# Altium project Fujin_V1.PrjPcb
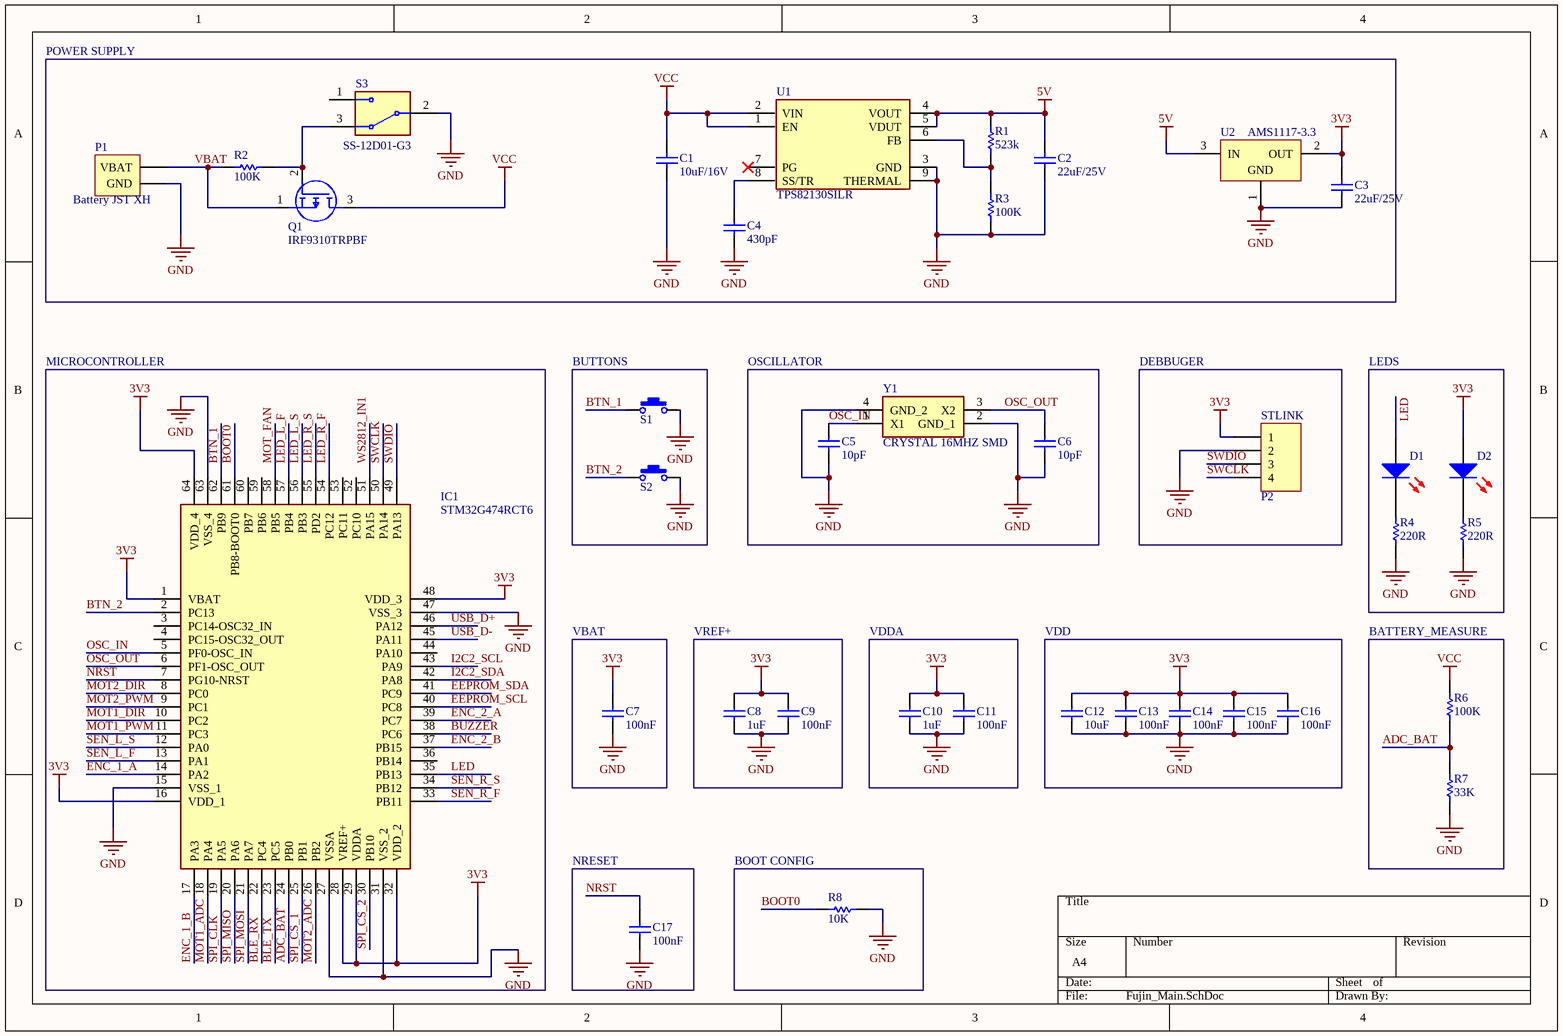
[diagram p0: Fujin_Main.SchDoc]
4 sheets, 108 parts. Net scope: global (net labels, ports and power ports of the same name join across sheets).
Board file: Fujin_Body.PcbDoc
Sheets:
  Fujin_Main.SchDoc
  Fujin_Peripherals.SchDoc
  Fujin_Motors.SchDoc
  Fujin_Connectors.SchDoc

## Sheet Fujin_Main.SchDoc
size A4; SheetNumber: 1; SheetTotal: 4

### Parts
C1  10uF/16V  [CAPACITOR-0805]
C2  22uF/25V  [CAPACITOR-0805]
C3  22uF/25V  [CAPACITOR-0805]
C4  430pF  [Capacitor-0603]
C5  10pF  [CAP 0402]
C6  10pF  [CAP 0402]
C7  100nF  [CAP 0402]
C8  1uF  [Capacitor-0603]
C9  100nF  [CAP 0402]
C10  1uF  [Capacitor-0603]
C11  100nF  [CAP 0402]
C12  10uF  [CAPACITOR-0805]
C13  100nF  [CAP 0402]
C14  100nF  [CAP 0402]
C15  100nF  [CAP 0402]
C16  100nF  [CAP 0402]
C17  100nF  [CAP 0402]
D1  LED RED 0603  [LED 0603]  (value not drawn)
D2  LED RED 0603  [LED 0603]  (value not drawn)
IC1  STM32G474RCT6  [QFP50P1200X1200X160-64N]
P1  Battery JST XH  [JST XH 1x2 Straight]
P2  Header 1x4  [HDR MALE 1x4]  (value not drawn)
Q1  IRF9310TRPBF  [IRF9310TRPBF]
R1  523k  [RESISTOR 0603]
R2  100K  [RESISTOR 0603]
R3  100K  [RESISTOR 0603]
R4  220R  [RESISTOR 0603]
R5  220R  [RESISTOR 0603]
R6  100K  [RESISTOR 0603]
R7  33K  [RESISTOR 0603]
R8  10K  [RESISTOR 0402]
S1  SPST-NO  [B3U-1000P]  (value not drawn)
S2  SPST-NO  [B3U-1000P]  (value not drawn)
S3  SS-12D01-G3  [DEALON SS-12D01-G3]
U1  TPS82130SILR  [SIL0008D]
U2  AMS1117-3.3  [SOT223 - AMS1117]
Y1  CRYSTAL 16MHZ SMD  [ABM10W240000MHZ8K1ZT3]

### Blocks framed on the sheet
POWER SUPPLY: C1-C4 P1 Q1 R1-R3 S3 U1 U2
MICROCONTROLLER: IC1
BUTTONS: S1 S2
OSCILLATOR: C5 C6 Y1
LEDS: D1 D2 R4 R5
VBAT: C7
VREF+: C8 C9
VDDA: C10 C11
VDD: C12-C16
BATTERY_MEASURE: R6 R7
NRESET: C17
BOOT CONFIG: R8

### Nets
3V3: C3.2 C7.2 C8.2 C9.2 C10.2 C11.2 C12.2 C13.2 C14.2 C15.2 C16.2 D2.1(A) IC1.1(VBAT) IC1.16(VDD_1) IC1.28(VREF+) IC1.29(VDDA) IC1.32(VDD_2) IC1.48(VDD_3) IC1.64(VDD_4) P2.1 U2.2(OUT)
5V: C2.2 R1.2 U1.4(VOUT) U1.5(VDUT) U2.3(IN)
GND: C1.1 C2.1 C3.1 C4.1 C5.1 C6.1 C7.1 C8.1 C9.1 C10.1 C11.1 C12.1 C13.1 C14.1 C15.1 C16.1 C17.1 IC1.15(VSS_1) IC1.27(VSSA) IC1.31(VSS_2) IC1.47(VSS_3) IC1.63(VSS_4) P1.2(GND) P2.2 R3.1 R4.1 R5.1 R7.1 R8.2 S1.2 S2.2 S3.2(COM) U1.3(GND) U1.9(THERMAL) U2.1(GND) Y1.2(GND_1) Y1.4(GND_2)
VCC: C1.2 Q1.3(D) R6.2 U1.1(EN) U1.2(VIN)
ADC_BAT: IC1.24(PB0) R6.1 R7.2
BLE_RX: IC1.22(PC4)
BLE_TX: IC1.23(PC5)
BOOT0: IC1.61(PB8-BOOT0) R8.1
BTN_1: IC1.62(PB9) S1.1
BTN_2: IC1.2(PC13) S2.1
BUZZER: IC1.38(PC6)
EEPROM_SCL: IC1.40(PC8)
EEPROM_SDA: IC1.41(PC9)
ENC_1_A: IC1.14(PA2)
ENC_1_B: IC1.17(PA3)
ENC_2_A: IC1.39(PC7)
ENC_2_B: IC1.37(PB15)
I2C2_SCL: IC1.43(PA9)
I2C2_SDA: IC1.42(PA8)
LED: D1.1(A) IC1.35(PB13)
LED_L_F: IC1.57(PB4)
LED_L_S: IC1.56(PB3)
LED_R_F: IC1.54(PC12)
LED_R_S: IC1.55(PD2)
MOT1_ADC: IC1.18(PA4)
MOT1_DIR: IC1.10(PC2)
MOT1_PWM: IC1.11(PC3)
MOT2_ADC: IC1.26(PB2)
MOT2_DIR: IC1.8(PC0)
MOT2_PWM: IC1.9(PC1)
MOT_FAN: IC1.58(PB5)
NRST: C17.2 IC1.7(PG10-NRST)
OSC_IN: C5.2 IC1.5(PF0-OSC_IN) Y1.1(X1)
OSC_OUT: C6.2 IC1.6(PF1-OSC_OUT) Y1.3(X2)
SEN_L_F: IC1.13(PA1)
SEN_L_S: IC1.12(PA0)
SEN_R_F: IC1.33(PB11)
SEN_R_S: IC1.34(PB12)
SPI_CLK: IC1.19(PA5)
SPI_CS_1: IC1.25(PB1)
SPI_CS_2: IC1.30(PB10)
SPI_MISO: IC1.20(PA6)
SPI_MOSI: IC1.21(PA7)
SWCLK: IC1.50(PA14) P2.4
SWDIO: IC1.49(PA13) P2.3
USB_D+: IC1.46(PA12)
USB_D-: IC1.45(PA11)
VBAT: P1.1(VBAT) Q1.1(S) R2.1
WS2812_IN1: IC1.51(PA15)
NetC4_2: C4.2 U1.8(SS/TR)
NetD1_2: D1.2(K) R4.2
NetD2_2: D2.2(K) R5.2
NetQ1_2: Q1.2(G) R2.2 S3.3(NO)
NetR1_1: R1.1 R3.2 U1.6(FB)

Not connected (* = marked no-connect by the designer): IC1 3(PC14-OSC32_IN) 4(PC15-OSC32_OUT) 36(PB14) 44(PA10) 52(PC10) 53(PC11) 59(PB6) 60(PB7); S3 1(NC); U1 7(PG)*

### Notes on the sheet
- DEBBUGER
- (near P2) STLINK

### Library data of the parts
C1 C12 = CAP CER 10UF 16V X5R 0805: Manufacturer: AVX Corporation; Manufacturer Part Number: 0805YD106KAT2A; Capacitance: 10µF; Tolerance: ±10%; Supplier 1: Digi-Key; RoHS: RoHS Compliant; Category: Capacitors; Stock 1: 198871; Pricing 1: 1=0.18, 10=0.124, 25=0.0908, 50=0.0742, 100=0.0627, 250=0.05116, 500=0.0429, 1000=0.03795 (USD); Packaging: Cut Tape (CT); Part Status: Active; Voltage - Rated: 16V; Temperature Coefficient: X5R; Mounting Type: Surface Mount, MLCC; Operating Temperature: -55°C ~ 85°C; Applications: General Purpose; Ratings: -; Package / Case: 0805 (2012 Metric); Size / Dimension: 0.079" L x 0.049" W (2.01mm x 1.25mm); Height - Seated (Max): -; Thickness (Max): 0.055" (1.40mm); Lead Spacing: -; Features: -; Lead Style: -; ComponentLink1URL: http://datasheets.avx.com/cx5r.pdf; ComponentLink1Description: http://datasheets.avx.com/cx5r.pdf; Supplier Part Number 1: 478-5165-1-ND
C2 C3 = CAP CER 22UF 25V X5R 0805: Manufacturer: AVX Corporation; Manufacturer Part Number: 0805YD106KAT2A; Capacitance: 10µF; Tolerance: ±10%; Voltage - Rated: 16V; Supplier 1: Digi-Key; RoHS: RoHS Compliant; Category: Capacitors; Stock 1: 198871; Pricing 1: 1=0.18, 10=0.124, 25=0.0908, 50=0.0742, 100=0.0627, 250=0.05116, 500=0.0429, 1000=0.03795 (USD); Packaging: Cut Tape (CT); Part Status: Active; Temperature Coefficient: X5R; Mounting Type: Surface Mount, MLCC; Operating Temperature: -55°C ~ 85°C; Applications: General Purpose; Ratings: -; Package / Case: 0805 (2012 Metric); Size / Dimension: 0.079" L x 0.049" W (2.01mm x 1.25mm); Height - Seated (Max): -; Thickness (Max): 0.055" (1.40mm); Lead Spacing: -; Features: -; Lead Style: -; ComponentLink1URL: https://www.lcsc.com/product-detail/Multilayer-Ceramic-Capacitors-MLCC-SMD-SMT_Murata-Electronics-GRM21BR61E226ME44L_C86816.html; ComponentLink1Description: http://datasheets.avx.com/cx5r.pdf; Supplier Part Number 1: 478-5165-1-ND
C4 = CAP 430pF: Capacitor Cer 430pF; Manufacturer Part Number: IMP14925; Product Range: MCFY Series; Capacitance Tolerance: +80%, -20%; Dielectric Characteristic: Y5; Voltage Rating: 50; Capacitor Terminals: Radial Leaded; SVHC: No SVHC (15-Jun-2015); Supplier 1: Mult Comercial; Manufacturer: -; RoHS: YES; Stock 1: 115809; Pricing 1: 1=0.10 (BRL); Packaging: Each; Lead Spacing: 5; Operating Temperature Min: -25; Operating Temperature Max: 85; Capacitance Tolerance ±: +80%, -20%; Operating Temperature Range: -25°C to +85°C<!--FANDB--><div class="features-and-benefits-container"><div class="features-and-benefits-description"><span class="features-benefits-value">The MCFY series from Multicomp are radial leaded ceramic disc capacitors. The capacitance values ranges from 6800pF to 0.22?F.</span></div><div class="features-and-benefits-list"><ul class="features-and-benefits-list-list"><li class="features-and-benefits-list-item">Large capacitance in small size</li><li class="features-and-benefits-list-item">Rated voltage of 50V</li><li class="features-and-benefits-list-item">80%/-20% tolerance</li><li class="features-and-benefits-list-item">Operating temperature range -25°C to +85; ComponentLink1URL: http://loja.multcomercial.com.br/capacitor-ceramico-disco-100kpf-50v-104-100k-100nf-0-1uf-cod-1351.html; ComponentLink1Description: http://loja.multcomercial.com.br/capacitor-ceramico-disco-100kpf-50v-104-100k-100nf-0-1uf-cod-1351.html; Supplier Part Number 1: Capacitor Cerâmico Disco 100Kpf/50V (104/100K/100nF/0.1uF) cód. 1351
C5 C6 = CAP 10pF: Capacitor Cer 10pF; Manufacturer Part Number: IMP14925; Product Range: MCFY Series; Capacitance Tolerance: +80%, -20%; Dielectric Characteristic: Y5; Voltage Rating: 50; Capacitor Terminals: Radial Leaded; SVHC: No SVHC (15-Jun-2015); Supplier 1: Mult Comercial; Manufacturer: -; RoHS: YES; Stock 1: 115809; Pricing 1: 1=0.10 (BRL); Packaging: Each; Lead Spacing: 5; Operating Temperature Min: -25; Operating Temperature Max: 85; Capacitance Tolerance ±: +80%, -20%; Operating Temperature Range: -25°C to +85°C<!--FANDB--><div class="features-and-benefits-container"><div class="features-and-benefits-description"><span class="features-benefits-value">The MCFY series from Multicomp are radial leaded ceramic disc capacitors. The capacitance values ranges from 6800pF to 0.22?F.</span></div><div class="features-and-benefits-list"><ul class="features-and-benefits-list-list"><li class="features-and-benefits-list-item">Large capacitance in small size</li><li class="features-and-benefits-list-item">Rated voltage of 50V</li><li class="features-and-benefits-list-item">80%/-20% tolerance</li><li class="features-and-benefits-list-item">Operating temperature range -25°C to +85; ComponentLink1URL: http://loja.multcomercial.com.br/capacitor-ceramico-disco-100kpf-50v-104-100k-100nf-0-1uf-cod-1351.html; ComponentLink1Description: http://loja.multcomercial.com.br/capacitor-ceramico-disco-100kpf-50v-104-100k-100nf-0-1uf-cod-1351.html; Supplier Part Number 1: Capacitor Cerâmico Disco 100Kpf/50V (104/100K/100nF/0.1uF) cód. 1351
C7 C9 C11 C13-C17 = CAP 100NF 50V 0402: Capacitor Cer 100nF 50V 0402; Manufacturer Part Number: IMP14925; Product Range: MCFY Series; Capacitance: 0.1uF; Capacitance Tolerance: +80%, -20%; Dielectric Characteristic: Y5; Voltage Rating: 50; Capacitor Terminals: Radial Leaded; SVHC: No SVHC (15-Jun-2015); Supplier 1: Mult Comercial; Manufacturer: -; RoHS: YES; Stock 1: 115809; Pricing 1: 1=0.10 (BRL); Packaging: Each; Lead Spacing: 5; Operating Temperature Min: -25; Operating Temperature Max: 85; Capacitance Tolerance ±: +80%, -20%; Operating Temperature Range: -25°C to +85°C<!--FANDB--><div class="features-and-benefits-container"><div class="features-and-benefits-description"><span class="features-benefits-value">The MCFY series from Multicomp are radial leaded ceramic disc capacitors. The capacitance values ranges from 6800pF to 0.22?F.</span></div><div class="features-and-benefits-list"><ul class="features-and-benefits-list-list"><li class="features-and-benefits-list-item">Large capacitance in small size</li><li class="features-and-benefits-list-item">Rated voltage of 50V</li><li class="features-and-benefits-list-item">80%/-20% tolerance</li><li class="features-and-benefits-list-item">Operating temperature range -25°C to +85; ComponentLink1URL: http://loja.multcomercial.com.br/capacitor-ceramico-disco-100kpf-50v-104-100k-100nf-0-1uf-cod-1351.html; ComponentLink1Description: http://loja.multcomercial.com.br/capacitor-ceramico-disco-100kpf-50v-104-100k-100nf-0-1uf-cod-1351.html; Supplier Part Number 1: Capacitor Cerâmico Disco 100Kpf/50V (104/100K/100nF/0.1uF) cód. 1351
C8 C10 = CAP CER 1UF 50V 0603: Multilayer Ceramic Capacitors MLCC - SMD/SMT 1uF 50Volts X5R +/-10% 0603 STD; Manufacturer: Taiyo Yuden; Manufacturer Part Number: UMK107BJ105KA-T; Tolerance: 10 %; Type: Industrial/Automotive and Safety; Voltage Rating DC: 50 VDC; Class: Class 2; Qualification: AEC-Q200; Supplier 1: Mouser; RoHS: RoHS Compliant; Category: Multilayer Ceramic Capacitors MLCC - SMD/SMT; Stock 1: 123303; Pricing 1: 1=0.512, 10=0.187, 100=0.101, 500=0.072, 1000=0.053, 4000=0.053, 8000=0.038, 12000=0.034, 24000=0.032 (AUD); Capacitance: 1 uF; Height: 0.8 mm; Length: 1.6 mm; Package / Case: 0603 (1608 metric); Packaging: Reel; Product: General Type MLCCs; Series: M; Termination Style: SMD/SMT; Width: 0.8 mm; Brand: Taiyo Yuden; Case Code - in: 0603; Case Code - mm: 1608; Dielectric: X5R; Maximum Operating Temperature: + 85 C; Minimum Operating Temperature: - 55 C; Termination: -; RoHS - Mouser: Y; Minimum Order Quantity: 1; Reeling: True; ComponentLink1URL: http://www.mouser.com/ds/2/396/mlcc_all_e-541559.pdf; ComponentLink1Description: http://www.mouser.com/ds/2/396/mlcc_all_e-541559.pdf; Supplier Part Number 1: 1uF
D1 D2 = LED RED 0603: LED; Manufacturer_Name: ROHM Semiconductor; Manufacturer_Part_Number: SML-D12U1WT86; Datasheet Link: https://componentsearchengine.com/Datasheets/1/SML-D12U1WT86.pdf; Height: 0.65mm; Mouser Part Number: 755-SML-D12U1WT86; Mouser Price/Stock: https://www.mouser.co.uk/ProductDetail/ROHM-Semiconductor/SML-D12U1WT86?qs=M3jcYzEJUdEySuGkbjHEtQ%3D%3D
IC1 = STM32G474RCT6: Integrated Circuit; Manufacturer_Name: STMicroelectronics; Datasheet Link: https://www.mouser.it/datasheet/2/389/dm00431551-1799305.pdf; Height: 1.6mm; Manufacturer_Part_Number: STM32G474RCT6; Mouser Part Number: 511-STM32G474RCT6; Mouser Price/Stock: https://www.mouser.co.uk/ProductDetail/STMicroelectronics/STM32G474RCT6?qs=uwxL4vQweFOU%2FtVbMPY7ow%3D%3D
P1 = Battery Connector
P2 = Header 1x4: Headers & Wire Housings 40Pin 2mm Spacing Single Row Hdrs, 5pc; Manufacturer: Cromax; Manufacturer Part Number: IMP10327; Mounting Angle: Vertical; Number of Positions: 40 Position; Supplier 1: Mult Comercial; RoHS: RoHS Compliant; Category: Headers & Wire Housings; Stock 1: 14; Pricing 1: 1=1.00, 5=0.20 (BRL); Accessory Type: -; Contact Plating: Gold; Contact Type: -; Number of Rows: 1 Row; Product: Headers; Termination Style: Through Hole; Type: Breakaway; Brand: Cromax; Mounting Style: Straight Pin; Pitch: 2 mm; Row Spacing: -; Contact Gender: Pin (Male); Product Category: Accessories; RoHS - Mouser: Y; Minimum Order Quantity: 1; Reeling: False; ComponentLink1URL: http://loja.multcomercial.com.br/barra-de-pinos-simples-1x40-macho-bmo40-1e.html; ComponentLink1Description: http://loja.multcomercial.com.br/barra-de-pinos-simples-1x40-macho-bmo40-1e.html; Supplier Part Number 1: Barra de Pinos Simples 1x40 Macho BMO40-1E
Q1 = IRF9310TRPBF: MOSFET (P-Channel); Manufacturer_Name: Infineon; Datasheet Link: http://uk.rs-online.com/web/p/products/8273912; Height: 1.75mm; Manufacturer_Part_Number: IRF9310TRPBF; Mouser Part Number: 942-IRF9310TRPBF; Mouser Price/Stock: https://www.mouser.co.uk/ProductDetail/Infineon-Technologies/IRF9310TRPBF?qs=9%252BKlkBgLFf0NoechZyOTDg%3D%3D; Arrow Part Number: IRF9310TRPBF; Arrow Price/Stock: https://www.arrow.com/en/products/irf9310trpbf/infineon-technologies-ag
R1 = RES 523K 1%: ComponentLink1URL: http://www.farnell.com/datasheets/1678796.pdf; ComponentLink1Description: http://www.farnell.com/datasheets/1678796.pdf; Category: Resistors; Resistance (Ohms): 523k; ComponentLink2URL: http://industrial.panasonic.com/www-cgi/jvcr13pz.cgi?E+PZ+3+AOA0001+ERJ3GEYJ103V+7+WW; ComponentLink2Description: http://industrial.panasonic.com/www-cgi/jvcr13pz.cgi?E+PZ+3+AOA0001+ERJ3GEYJ103V+7+WW
R2 = RES 100K 5%: ComponentLink1URL: http://www.farnell.com/datasheets/1678796.pdf; ComponentLink1Description: http://www.farnell.com/datasheets/1678796.pdf; Category: Resistors; Resistance (Ohms): 100k; ComponentLink2URL: http://industrial.panasonic.com/www-cgi/jvcr13pz.cgi?E+PZ+3+AOA0001+ERJ3GEYJ103V+7+WW; ComponentLink2Description: http://industrial.panasonic.com/www-cgi/jvcr13pz.cgi?E+PZ+3+AOA0001+ERJ3GEYJ103V+7+WW
R3 R6 = RES 100K 1%: ComponentLink1URL: http://www.farnell.com/datasheets/1678796.pdf; ComponentLink1Description: http://www.farnell.com/datasheets/1678796.pdf; Category: Resistors; Resistance (Ohms): 100k; ComponentLink2URL: http://industrial.panasonic.com/www-cgi/jvcr13pz.cgi?E+PZ+3+AOA0001+ERJ3GEYJ103V+7+WW; ComponentLink2Description: http://industrial.panasonic.com/www-cgi/jvcr13pz.cgi?E+PZ+3+AOA0001+ERJ3GEYJ103V+7+WW
R4 R5 = RES 220R 5%_1: Manufacturer: Ty-Ohm; Manufacturer Part Number: CR25; Tolerance: ±5%; Power (Watts): 0.25W, 1/4W; Temperature Coefficient: 0/ -500ppm/°C; Resistance (Ohms): 470R; Supplier 1: Mult Comercial; RoHS: RoHS Compliant; Category: Resistors; Stock 1: 617543; Pricing 1: 1=0.20 (BRL); Packaging: Cut Tape (CT); Composition: Carbon Film; Features: Flame Retardant Coating, Safety; Operating Temperature: -55°C ~ 155°C; Package / Case: Axial; Supplier Device Package: Axial; Size / Dimension: 0.091" Dia x 0.256" L (2.30mm x 6.50mm); Height: -; Number of Terminations: 2; ComponentLink1URL: http://loja.multcomercial.com.br/resistor-de-1-4-de-watt-cr25-5-de-tolerancia.html; ComponentLink1Description: http://loja.multcomercial.com.br/resistor-de-1-4-de-watt-cr25-5-de-tolerancia.html; Supplier Part Number 1: Resistor de Filme de Carbono 1/4 de Watt CR25 5% de tolerância - 0.22R Ω à 10M Ω
R7 = RES 33K 1%: ComponentLink1URL: http://www.farnell.com/datasheets/1678796.pdf; ComponentLink1Description: http://www.farnell.com/datasheets/1678796.pdf; ComponentLink2URL: http://industrial.panasonic.com/www-cgi/jvcr13pz.cgi?E+PZ+3+AOA0001+ERJ3GEYJ103V+7+WW; ComponentLink2Description: http://industrial.panasonic.com/www-cgi/jvcr13pz.cgi?E+PZ+3+AOA0001+ERJ3GEYJ103V+7+WW
R8 = RES 10K 5%: Manufacturer: PANASONIC ELECTRONIC COMPONENTS; Manufacturer Part Number: ERJ-3GEYJ103V; Tolerance: ±5%; Power (Watts): 0.1W, 1/10W; Temperature Coefficient: ±200ppm/°C; RoHS: YES; ComponentLink1URL: http://www.farnell.com/datasheets/1678796.pdf; ComponentLink1Description: http://www.farnell.com/datasheets/1678796.pdf; Category: Resistors; Packaging: Tape & Reel (TR); Resistance (Ohms): 10k; Composition: Thick Film; Features: Automotive AEC-Q200; Operating Temperature: -55°C ~ 155°C; Package / Case: 0603 (1608 Metric); Supplier Device Package: 0603; Size / Dimension: 0.063" L x 0.031" W (1.60mm x 0.80mm); Height: 0.022" (0.55mm); Number of Terminations: 2; ComponentLink2URL: http://industrial.panasonic.com/www-cgi/jvcr13pz.cgi?E+PZ+3+AOA0001+ERJ3GEYJ103V+7+WW; ComponentLink2Description: http://industrial.panasonic.com/www-cgi/jvcr13pz.cgi?E+PZ+3+AOA0001+ERJ3GEYJ103V+7+WW
S1 S2 = Switch Tactile B3U-1000P: Manufacturer: Omron; Supplier 1: Digi-Key; ComponentLink1URL: https://br.mouser.com/ProductDetail/Omron-Electronics/B3U-1000P?qs=AO7BQMcsEu4ip80xyf2FwA%3D%3D; ComponentLink1Description: http://industrial.panasonic.com/cdbs/www-data/pdf/ATK0000/ATK0000CE10.pdf
S3 = 1101M2S3CGE2: Switch; Manufacturer_Name: C & K COMPONENTS; Alternate Part Number: XKB Connection SS-12D10L5; Datasheet Link: https://www.ckswitches.com/media/1429/1000.pdf; Height: 11.43mm; Manufacturer_Part_Number: 1101M2S3CGE2; Mouser Part Number: 611-1101M2S3CGE2; Mouser Price/Stock: https://www.mouser.co.uk/ProductDetail/CK/1101M2S3CGE2?qs=lwH5WijZ8ehN3XG160Un%2Fg%3D%3D; Arrow Part Number: 1101M2S3CGE2; Arrow Price/Stock: https://www.arrow.com/en/products/1101m2s3cge2/ck; Alternate Link: https://www.lcsc.com/product-detail/Slide-Switches_XKB-Connection-SS-12D10L5_C319012.html; LCSC Part: C319012
U1 = TPS82130SILR: Undefined or Miscellaneous; Manufacturer_Name: Texas Instruments; Datasheet Link: http://www.ti.com/lit/gpn/tps82130; Manufacturer_Part_Number: TPS82130SILR; Mouser Part Number: 595-TPS82130SILR; Mouser Price/Stock: https://www.mouser.co.uk/ProductDetail/Texas-Instruments/TPS82130SILR?qs=diC8vqfyxkoyC4Q%252BBNy%2FPA%3D%3D; Arrow Part Number: TPS82130SILR; Arrow Price/Stock: https://www.arrow.com/en/products/tps82130silr/texas-instruments?region=europe
Y1 = CRYSTAL 16MHZ SMD: CRYSTAL 16MHZ; Manufacturer_Name: ABRACON; Manufacturer_Part_Number: ABM10W-16.0000MHZ-4-B1U-T3; Datasheet Link: https://www.abracon.com/Resonators/ABM10W.pdf; Height: 0.6mm; Mouser Part Number: 815-10W16-4B1UT; Mouser Price/Stock: https://www.mouser.co.uk/ProductDetail/ABRACON/ABM10W-16.0000MHZ-4-B1U-T3?qs=5aG0NVq1C4x2nD%252BLlu9wCg%3D%3D; Arrow Part Number: ABM10W-16.0000MHZ-4-B1U-T3; Arrow Price/Stock: https://www.arrow.com/en/products/abm10w-16.0000mhz-4-b1u-t3/abracon?region=nac

## Sheet Fujin_Peripherals.SchDoc
size A4; SheetNumber: 2; SheetTotal: 4
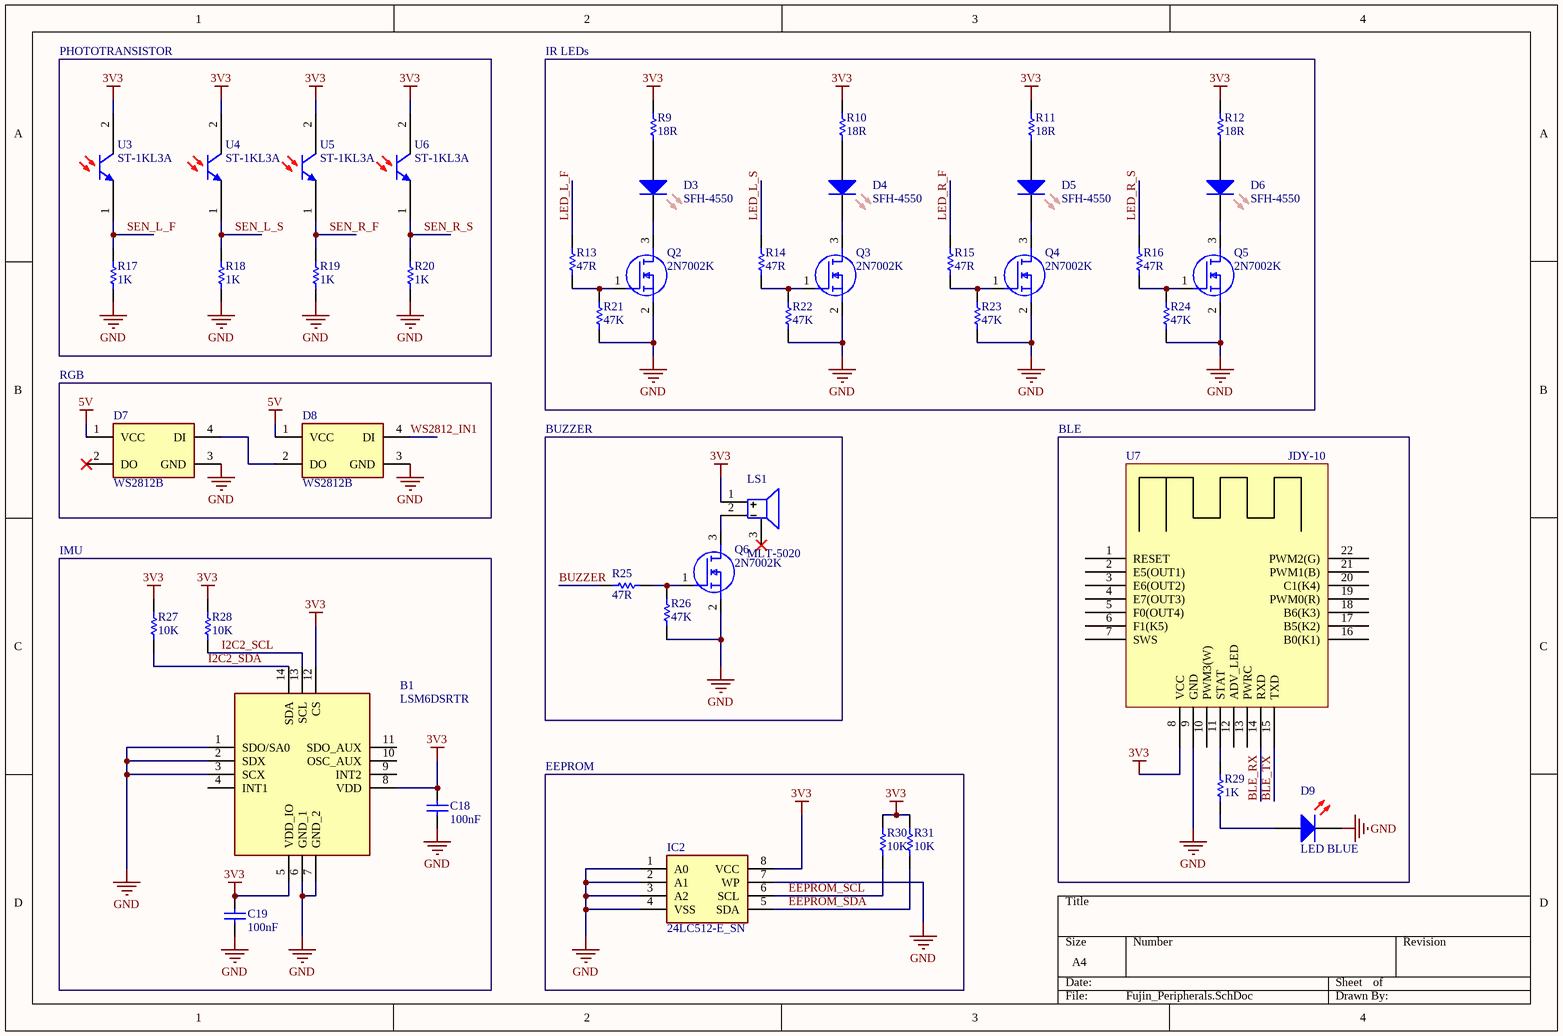
[diagram p1: Fujin_Peripherals.SchDoc]

### Parts
B1  LSM6DSRTR  [QFN50P300X250X86-14N]
C18  100nF  [CAP 0402]
C19  100nF  [CAP 0402]
D3  SFH-4550  [SFH-4550]
D4  SFH-4550  [SFH-4550]
D5  SFH-4550  [SFH-4550]
D6  SFH-4550  [SFH-4550]
D7  WS2812B  [WS2812B]
D8  WS2812B  [WS2812B]
D9  LED BLUE  [LED 0603]
IC2  24LC512-E_SN  [SOIC127P600X175-8N]
LS1  MLT-5020  [MLT-5020]
Q2  2N7002K  [SOT95P240X120-3N]
Q3  2N7002K  [SOT95P240X120-3N]
Q4  2N7002K  [SOT95P240X120-3N]
Q5  2N7002K  [SOT95P240X120-3N]
Q6  2N7002K  [SOT95P240X120-3N]
R9  18R  [RESISTOR 0603]
R10  18R  [RESISTOR 0603]
R11  18R  [RESISTOR 0603]
R12  18R  [RESISTOR 0603]
R13  47R  [RESISTOR 0603]
R14  47R  [RESISTOR 0603]
R15  47R  [RESISTOR 0603]
R16  47R  [RESISTOR 0603]
R17  1K  [RESISTOR 0603]
R18  1K  [RESISTOR 0603]
R19  1K  [RESISTOR 0603]
R20  1K  [RESISTOR 0603]
R21  47K  [RESISTOR 0603]
R22  47K  [RESISTOR 0603]
R23  47K  [RESISTOR 0603]
R24  47K  [RESISTOR 0603]
R25  47R  [RESISTOR 0603]
R26  47K  [RESISTOR 0603]
R27  10K  [RESISTOR 0402]
R28  10K  [RESISTOR 0402]
R29  1K  [RESISTOR 0603]
R30  10K  [RESISTOR 0402]
R31  10K  [RESISTOR 0402]
U3  ST-1KL3A  [ST-1KL3A]
U4  ST-1KL3A  [ST-1KL3A]
U5  ST-1KL3A  [ST-1KL3A]
U6  ST-1KL3A  [ST-1KL3A]
U7  JDY-10  [JDY-10 - Half]

### Blocks framed on the sheet
PHOTOTRANSISTOR: R17-R20 U3-U6
IR LEDs: D3-D6 Q2-Q5 R9-R16 R21-R24
RGB: D7 D8
BUZZER: LS1 Q6 R25 R26
BLE: D9 R29 U7
IMU: B1 C18 C19 R27 R28
EEPROM: IC2 R30 R31

### Nets
3V3: B1.5(VDD_IO) B1.8(VDD) B1.12(CS) C18.2 C19.2 IC2.8(VCC) LS1.1(+) R9.2 R10.2 R11.2 R12.2 R27.2 R28.2 R30.2 R31.2 U3.2(COLLECTOR) U4.2(COLLECTOR) U5.2(COLLECTOR) U6.2(COLLECTOR) U7.8(VCC)
5V: D7.1(VCC) D8.1(VCC)
GND: B1.1(SDO/SA0) B1.2(SDX) B1.3(SCX) B1.6(GND_1) B1.7(GND_2) C18.1 C19.1 D7.3(GND) D8.3(GND) D9.2(K) IC2.1(A0) IC2.2(A1) IC2.3(A2) IC2.4(VSS) IC2.7(WP) Q2.2(S) Q3.2(S) Q4.2(S) Q5.2(S) Q6.2(S) R17.1 R18.1 R19.1 R20.1 R21.1 R22.1 R23.1 R24.1 R26.1 U7.9(GND)
BLE_RX: U7.14(RXD)
BLE_TX: U7.15(TXD)
BUZZER: R25.1
EEPROM_SCL: IC2.6(SCL) R30.1
EEPROM_SDA: IC2.5(SDA) R31.1
I2C2_SCL: B1.13(SCL) R28.1
I2C2_SDA: B1.14(SDA) R27.1
LED_L_F: R13.2
LED_L_S: R14.2
LED_R_F: R15.2
LED_R_S: R16.2
SEN_L_F: R17.2 U3.1(EMITTER)
SEN_L_S: R18.2 U4.1(EMITTER)
SEN_R_F: R19.2 U5.1(EMITTER)
SEN_R_S: R20.2 U6.1(EMITTER)
WS2812_IN1: D8.4(DI)
NetD3_1: D3.1(A) R9.1
NetD3_2: D3.2(K) Q2.3(D)
NetD4_1: D4.1(A) R10.1
NetD4_2: D4.2(K) Q3.3(D)
NetD5_1: D5.1(A) R11.1
NetD5_2: D5.2(K) Q4.3(D)
NetD6_1: D6.1(A) R12.1
NetD6_2: D6.2(K) Q5.3(D)
NetD7_4: D7.4(DI) D8.2(DO)
NetD9_1: D9.1(A) R29.1
NetLS1_2: LS1.2(-) Q6.3(D)
NetQ2_1: Q2.1(G) R13.1 R21.2
NetQ3_1: Q3.1(G) R14.1 R22.2
NetQ4_1: Q4.1(G) R15.1 R23.2
NetQ5_1: Q5.1(G) R16.1 R24.2
NetQ6_1: Q6.1(G) R25.2 R26.2
NetR29_2: R29.2 U7.11(STAT)

Not connected (* = marked no-connect by the designer): B1 4(INT1) 9(INT2) 10(OSC_AUX) 11(SDO_AUX); D7 2(DO)*; LS1 3(DUMMY)*; U7 1(RESET) 2(E5(OUT1)) 3(E6(OUT2)) 4(E7(OUT3)) 5(F0(OUT4)) 6(F1(K5)) 7(SWS) 10(PWM3(W)) 12(ADV_LED) 13(PWRC) 16(B0(K1)) 17(B5(K2)) 18(B6(K3)) 19(PWM0(R)) 20(C1(K4)) 21(PWM1(B)) 22(PWM2(G))

### Library data of the parts
B1 = LSM6DSRTR: IMUs - Inertial Measurement Units; Manufacturer_Name: STMicroelectronics; Geometry.Height: 0.86mm; Manufacturer_Part_Number: LSM6DSRTR; Mouser Part Number: *; Mouser Price/Stock: *; Arrow Part Number: *; Arrow Price/Stock: *; Datasheet Link: https://componentsearchengine.com/Datasheets/2/LSM6DSRTR.pdf
C18 C19 = CAP 100NF 50V 0402: as C7 on sheet Fujin_Main; Supplier 1: Mult Comercial; Manufacturer: -; RoHS: YES; Stock 1: 115809; Pricing 1: 1=0.10 (BRL); Packaging: Each; Lead Spacing: 5; Operating Temperature Min: -25; Operating Temperature Max: 85; Capacitance Tolerance ±: +80%, -20%; Operating Temperature Range: -25°C to +85°C<!--FANDB--><div class="features-and-benefits-container"><div class="features-and-benefits-description"><span class="features-benefits-value">The MCFY series from Multicomp are radial leaded ceramic disc capacitors. The capacitance values ranges from 6800pF to 0.22?F.</span></div><div class="features-and-benefits-list"><ul class="features-and-benefits-list-list"><li class="features-and-benefits-list-item">Large capacitance in small size</li><li class="features-and-benefits-list-item">Rated voltage of 50V</li><li class="features-and-benefits-list-item">80%/-20% tolerance</li><li class="features-and-benefits-list-item">Operating temperature range -25°C to +85; ComponentLink1URL: http://loja.multcomercial.com.br/capacitor-ceramico-disco-100kpf-50v-104-100k-100nf-0-1uf-cod-1351.html; ComponentLink1Description: http://loja.multcomercial.com.br/capacitor-ceramico-disco-100kpf-50v-104-100k-100nf-0-1uf-cod-1351.html; Supplier Part Number 1: Capacitor Cerâmico Disco 100Kpf/50V (104/100K/100nF/0.1uF) cód. 1351
D3-D6 = SFH-4550: LED 5mm IR; Manufacturer: OSRAM; Bulb Size: 5mm; Datasheet: https://look.ams-osram.com/m/7d214b223a9adb85/original/SFH-4550.pdf
D7 D8 = WS2812B: Diode; Manufacturer_Name: Worldsemi; Manufacturer_Part_Number: WS2812; Datasheet Link: https://www.adafruit.com/datasheets/WS2812.pdf
D9 = LED RED 0603: as D1 on sheet Fujin_Main; Datasheet Link: https://componentsearchengine.com/Datasheets/1/SML-D12U1WT86.pdf; Height: 0.65mm; Mouser Part Number: 755-SML-D12U1WT86; Mouser Price/Stock: https://www.mouser.co.uk/ProductDetail/ROHM-Semiconductor/SML-D12U1WT86?qs=M3jcYzEJUdEySuGkbjHEtQ%3D%3D
IC2 = 24LC512-E_SN: Integrated Circuit; Manufacturer_Name: Microchip; Manufacturer_Part_Number: 24LC512-E/SN; Datasheet Link: http://www.microchip.com/mymicrochip/filehandler.aspx?ddocname=en546203; Height: 1.75mm; Mouser Part Number: 579-24LC512-E/SN; Mouser Price/Stock: https://www.mouser.co.uk/ProductDetail/Microchip-Technology/24LC512-E-SN?qs=CtbZ3JXzXSq04R8z3pTI3A%3D%3D; Arrow Part Number: 24LC512-E/SN; Arrow Price/Stock: https://www.arrow.com/en/products/24lc512-esn/microchip-technology?region=nac
LS1 = MLT-5020: Loudspeaker or Buzzer; Manufacturer_Name: PUI Audio; Manufacturer_Part_Number: SMT-0540-S-R; Datasheet Link: http://www.puiaudio.com/pdf/SMT-0540-S-R.pdf; Height: 2mm; Mouser Part Number: 665-SMT0540SR; Mouser Price/Stock: https://www.mouser.co.uk/ProductDetail/PUI-Audio/SMT-0540-S-R?qs=e16JbV5WBEu5VaDVzQP23Q%3D%3D; LCSC: Jiangsu Huaneng Elec MLT-5020; Link: https://www.lcsc.com/product-detail/Buzzers_Jiangsu-Huaneng-Elec-MLT-5020_C94598.html
Q2-Q6 = 2N7002K: MOSFET (N-Channel); Manufacturer_Name: onsemi; Datasheet Link: https://componentsearchengine.com/Datasheets/2/2N7002K.pdf; Height: 1.2mm; Manufacturer_Part_Number: 2N7002K; Mouser Part Number: 512-2N7002K; Mouser Price/Stock: https://www.mouser.co.uk/ProductDetail/onsemi-Fairchild/2N7002K?qs=iS%252BvaFGfLorx0keKeEIrfg%3D%3D; Arrow Part Number: 2N7002K; Arrow Price/Stock: https://www.arrow.com/en/products/2n7002k/on-semiconductor?region=nac
R9-R12 = RES 18R 5%: Manufacturer: Ty-Ohm; Manufacturer Part Number: CR25; Tolerance: ±5%; Power (Watts): 0.25W, 1/4W; Temperature Coefficient: 0/ -500ppm/°C; Supplier 1: Mult Comercial; RoHS: RoHS Compliant; Category: Resistors; Stock 1: 617543; Pricing 1: 1=0.20 (BRL); Packaging: Cut Tape (CT); Composition: Carbon Film; Features: Flame Retardant Coating, Safety; Operating Temperature: -55°C ~ 155°C; Package / Case: Axial; Supplier Device Package: Axial; Size / Dimension: 0.091" Dia x 0.256" L (2.30mm x 6.50mm); Height: -; Number of Terminations: 2; ComponentLink1URL: http://loja.multcomercial.com.br/resistor-de-1-4-de-watt-cr25-5-de-tolerancia.html; ComponentLink1Description: http://loja.multcomercial.com.br/resistor-de-1-4-de-watt-cr25-5-de-tolerancia.html; Supplier Part Number 1: Resistor de Filme de Carbono 1/4 de Watt CR25 5% de tolerância - 0.22R Ω à 10M Ω; Resistance (Ohms): 18R
R13-R16 R25 = RES 47R 5%: Manufacturer: Ty-Ohm; Manufacturer Part Number: CR25; Tolerance: ±5%; Power (Watts): 0.25W, 1/4W; Temperature Coefficient: 0/ -500ppm/°C; Resistance (Ohms): 470R; Supplier 1: Mult Comercial; RoHS: RoHS Compliant; Category: Resistors; Stock 1: 617543; Pricing 1: 1=0.20 (BRL); Packaging: Cut Tape (CT); Composition: Carbon Film; Features: Flame Retardant Coating, Safety; Operating Temperature: -55°C ~ 155°C; Package / Case: Axial; Supplier Device Package: Axial; Size / Dimension: 0.091" Dia x 0.256" L (2.30mm x 6.50mm); Height: -; Number of Terminations: 2; ComponentLink1URL: http://loja.multcomercial.com.br/resistor-de-1-4-de-watt-cr25-5-de-tolerancia.html; ComponentLink1Description: http://loja.multcomercial.com.br/resistor-de-1-4-de-watt-cr25-5-de-tolerancia.html; Supplier Part Number 1: Resistor de Filme de Carbono 1/4 de Watt CR25 5% de tolerância - 0.22R Ω à 10M Ω
R17-R20 R29 = RES 1K 5%: Manufacturer: Ty-Ohm; Manufacturer Part Number: CR25; Tolerance: ±5%; Power (Watts): 0.25W, 1/4W; Temperature Coefficient: 0/ -500ppm/°C; Supplier 1: Mult Comercial; RoHS: RoHS Compliant; Category: Resistors; Stock 1: 617543; Pricing 1: 1=0.20 (BRL); Packaging: Cut Tape (CT); Composition: Carbon Film; Features: Flame Retardant Coating, Safety; Operating Temperature: -55°C ~ 155°C; Package / Case: Axial; Supplier Device Package: Axial; Size / Dimension: 0.091" Dia x 0.256" L (2.30mm x 6.50mm); Height: -; Number of Terminations: 2; ComponentLink1URL: http://loja.multcomercial.com.br/resistor-de-1-4-de-watt-cr25-5-de-tolerancia.html; ComponentLink1Description: http://loja.multcomercial.com.br/resistor-de-1-4-de-watt-cr25-5-de-tolerancia.html; Supplier Part Number 1: Resistor de Filme de Carbono 1/4 de Watt CR25 5% de tolerância - 0.22R Ω à 10M Ω; Resistance (Ohms): ?
R21-R24 R26 = RES 47K 5%: Manufacturer: Ty-Ohm; Manufacturer Part Number: CR25; Tolerance: ±5%; Power (Watts): 0.25W, 1/4W; Temperature Coefficient: 0/ -500ppm/°C; Supplier 1: Mult Comercial; RoHS: RoHS Compliant; Category: Resistors; Stock 1: 617543; Pricing 1: 1=0.20 (BRL); Packaging: Cut Tape (CT); Composition: Carbon Film; Features: Flame Retardant Coating, Safety; Operating Temperature: -55°C ~ 155°C; Package / Case: Axial; Supplier Device Package: Axial; Size / Dimension: 0.091" Dia x 0.256" L (2.30mm x 6.50mm); Height: -; Number of Terminations: 2; ComponentLink1URL: http://loja.multcomercial.com.br/resistor-de-1-4-de-watt-cr25-5-de-tolerancia.html; ComponentLink1Description: http://loja.multcomercial.com.br/resistor-de-1-4-de-watt-cr25-5-de-tolerancia.html; Supplier Part Number 1: Resistor de Filme de Carbono 1/4 de Watt CR25 5% de tolerância - 0.22R Ω à 10M Ω
R27 R28 R30 R31 = RES 10K 5%: as R8 on sheet Fujin_Main; RoHS: YES; ComponentLink1URL: http://www.farnell.com/datasheets/1678796.pdf; ComponentLink1Description: http://www.farnell.com/datasheets/1678796.pdf; Category: Resistors; Packaging: Tape & Reel (TR); Resistance (Ohms): 10k; Composition: Thick Film; Features: Automotive AEC-Q200; Operating Temperature: -55°C ~ 155°C; Package / Case: 0603 (1608 Metric); Supplier Device Package: 0603; Size / Dimension: 0.063" L x 0.031" W (1.60mm x 0.80mm); Height: 0.022" (0.55mm); Number of Terminations: 2; ComponentLink2URL: http://industrial.panasonic.com/www-cgi/jvcr13pz.cgi?E+PZ+3+AOA0001+ERJ3GEYJ103V+7+WW; ComponentLink2Description: http://industrial.panasonic.com/www-cgi/jvcr13pz.cgi?E+PZ+3+AOA0001+ERJ3GEYJ103V+7+WW
U3-U6 = ST-1KL3A: Phototransistor; Manufacturer_Name: Kodenshi; Datasheet Link: https://www.kodenshi.co.jp/top/wp-content/uploads/2022/03/ST-1KL3A.pdf
U7 = JDY-10-Bluetooth: ComponentLink1Description: Datasheet; ComponentLink1URL: http://myosuploads3.banggood.com/products/20190515/20190515052519JDY-10M.pdf

## Sheet Fujin_Motors.SchDoc
size A4; SheetNumber: 3; SheetTotal: 4
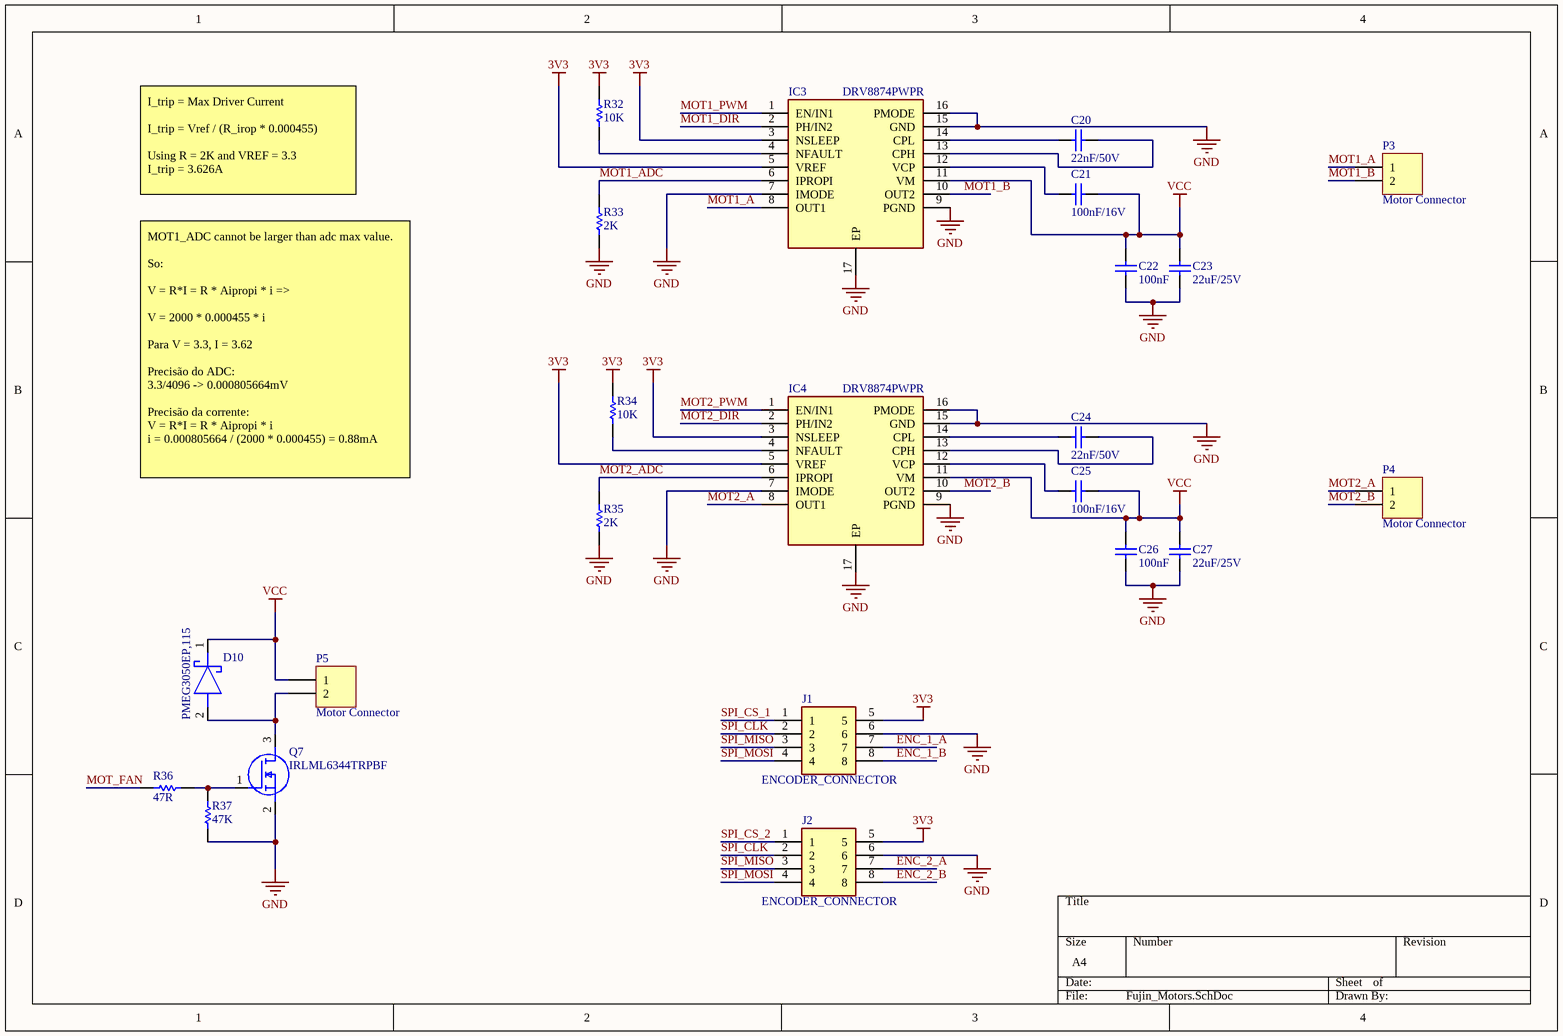
[diagram p2: Fujin_Motors.SchDoc]

### Parts
C20  22nF/50V  [Capacitor-0603]
C21  100nF/16V  [Capacitor-0603]
C22  100nF  [Capacitor-0603]
C23  22uF/25V  [CAPACITOR-0805]
C24  22nF/50V  [Capacitor-0603]
C25  100nF/16V  [Capacitor-0603]
C26  100nF  [Capacitor-0603]
C27  22uF/25V  [CAPACITOR-0805]
D10  PMEG3050EP,115  [PMEG3050EP115]
IC3  DRV8874PWPR  [SOP65P640X120-17N]
IC4  DRV8874PWPR  [SOP65P640X120-17N]
J1  ENCODER_CONNECTOR  [ENCODER_CONN]
J2  ENCODER_CONNECTOR  [ENCODER_CONN]
P3  Motor Connector  [MOTOR_CONNECTOR]
P4  Motor Connector  [MOTOR_CONNECTOR]
P5  Motor Connector  [MOTOR_CONNECTOR]
Q7  IRLML6344TRPBF  [SOT95P237X112-3N]
R32  10K  [RESISTOR 0402]
R33  2K  [RESISTOR 0603]
R34  10K  [RESISTOR 0402]
R35  2K  [RESISTOR 0603]
R36  47R  [RESISTOR 0402]
R37  47K  [RESISTOR 0402]

### Nets
3V3: IC3.3(NSLEEP) IC3.5(VREF) IC4.3(NSLEEP) IC4.5(VREF) J1.5 J2.5 R32.2 R34.2
GND: C22.1 C23.1 C26.1 C27.1 IC3.7(IMODE) IC3.9(PGND) IC3.15(GND) IC3.16(PMODE) IC3.17(EP) IC4.7(IMODE) IC4.9(PGND) IC4.15(GND) IC4.16(PMODE) IC4.17(EP) J1.6 J2.6 Q7.2(S) R33.1 R35.1 R37.1
VCC: C21.2 C22.2 C23.2 C25.2 C26.2 C27.2 D10.1(K) IC3.11(VM) IC4.11(VM) P5.1
ENC_1_A: J1.7
ENC_1_B: J1.8
ENC_2_A: J2.7
ENC_2_B: J2.8
MOT1_A: IC3.8(OUT1) P3.1
MOT1_ADC: IC3.6(IPROPI) R33.2
MOT1_B: IC3.10(OUT2) P3.2
MOT1_DIR: IC3.2(PH/IN2)
MOT1_PWM: IC3.1(EN/IN1)
MOT2_A: IC4.8(OUT1) P4.1
MOT2_ADC: IC4.6(IPROPI) R35.2
MOT2_B: IC4.10(OUT2) P4.2
MOT2_DIR: IC4.2(PH/IN2)
MOT2_PWM: IC4.1(EN/IN1)
MOT_FAN: R36.1
SPI_CLK: J1.2 J2.2
SPI_CS_1: J1.1
SPI_CS_2: J2.1
SPI_MISO: J1.3 J2.3
SPI_MOSI: J1.4 J2.4
NetC20_1: C20.1 IC3.14(CPL)
NetC20_2: C20.2 IC3.13(CPH)
NetC21_1: C21.1 IC3.12(VCP)
NetC24_1: C24.1 IC4.14(CPL)
NetC24_2: C24.2 IC4.13(CPH)
NetC25_1: C25.1 IC4.12(VCP)
NetD10_2: D10.2(A) P5.2 Q7.3(D)
NetIC3_4: IC3.4(NFAULT) R32.1
NetIC4_4: IC4.4(NFAULT) R34.1
NetQ7_1: Q7.1(G) R36.2 R37.2

### Notes on the sheet
- I_trip = Max Driver Current
  I_trip = Vref / (R_irop * 0.000455)
  Using R = 2K and VREF = 3.3
  I_trip = 3.626A
- MOT1_ADC cannot be larger than adc max value.
  So:
  V = R*I = R * Aipropi * i =>
  V = 2000 * 0.000455 * i
  Para V = 3.3, I = 3.62
  Precisão do ADC:
  3.3/4096 -> 0.000805664mV
  Precisão da corrente:
  V = R*I = R * Aipropi * i
  i = 0.000805664 / (2000 * 0.000455) = 0.88mA

### Library data of the parts
C20 C24 = CAP 22nF: Capacitor Cer 22nF 50V; Manufacturer Part Number: IMP14925; Product Range: MCFY Series; Capacitance Tolerance: +80%, -20%; Dielectric Characteristic: Y5; Voltage Rating: 50; Capacitor Terminals: Radial Leaded; SVHC: No SVHC (15-Jun-2015); Supplier 1: Mult Comercial; Manufacturer: -; RoHS: YES; Stock 1: 115809; Pricing 1: 1=0.10 (BRL); Packaging: Each; Lead Spacing: 5; Operating Temperature Min: -25; Operating Temperature Max: 85; Capacitance Tolerance ±: +80%, -20%; Operating Temperature Range: -25°C to +85°C<!--FANDB--><div class="features-and-benefits-container"><div class="features-and-benefits-description"><span class="features-benefits-value">The MCFY series from Multicomp are radial leaded ceramic disc capacitors. The capacitance values ranges from 6800pF to 0.22?F.</span></div><div class="features-and-benefits-list"><ul class="features-and-benefits-list-list"><li class="features-and-benefits-list-item">Large capacitance in small size</li><li class="features-and-benefits-list-item">Rated voltage of 50V</li><li class="features-and-benefits-list-item">80%/-20% tolerance</li><li class="features-and-benefits-list-item">Operating temperature range -25°C to +85; ComponentLink1URL: http://loja.multcomercial.com.br/capacitor-ceramico-disco-100kpf-50v-104-100k-100nf-0-1uf-cod-1351.html; ComponentLink1Description: http://loja.multcomercial.com.br/capacitor-ceramico-disco-100kpf-50v-104-100k-100nf-0-1uf-cod-1351.html; Supplier Part Number 1: Capacitor Cerâmico Disco 100Kpf/50V (104/100K/100nF/0.1uF) cód. 1351
C21 C25 = CAP 100NF 16V: Capacitor Cer 100nF 16VX7R; Manufacturer Part Number: IMP14925; Product Range: MCFY Series; Capacitance: 0.1uF; Capacitance Tolerance: +80%, -20%; Dielectric Characteristic: Y5; Voltage Rating: 50; Capacitor Terminals: Radial Leaded; SVHC: No SVHC (15-Jun-2015); Supplier 1: Mult Comercial; Manufacturer: -; RoHS: YES; Stock 1: 115809; Pricing 1: 1=0.10 (BRL); Packaging: Each; Lead Spacing: 5; Operating Temperature Min: -25; Operating Temperature Max: 85; Capacitance Tolerance ±: +80%, -20%; Operating Temperature Range: -25°C to +85°C<!--FANDB--><div class="features-and-benefits-container"><div class="features-and-benefits-description"><span class="features-benefits-value">The MCFY series from Multicomp are radial leaded ceramic disc capacitors. The capacitance values ranges from 6800pF to 0.22?F.</span></div><div class="features-and-benefits-list"><ul class="features-and-benefits-list-list"><li class="features-and-benefits-list-item">Large capacitance in small size</li><li class="features-and-benefits-list-item">Rated voltage of 50V</li><li class="features-and-benefits-list-item">80%/-20% tolerance</li><li class="features-and-benefits-list-item">Operating temperature range -25°C to +85; ComponentLink1URL: http://loja.multcomercial.com.br/capacitor-ceramico-disco-100kpf-50v-104-100k-100nf-0-1uf-cod-1351.html; ComponentLink1Description: http://loja.multcomercial.com.br/capacitor-ceramico-disco-100kpf-50v-104-100k-100nf-0-1uf-cod-1351.html; Supplier Part Number 1: Capacitor Cerâmico Disco 100Kpf/50V (104/100K/100nF/0.1uF) cód. 1351
C22 C26 = CAP 100NF 50V: Capacitor Cer 100nF 50V; Manufacturer Part Number: IMP14925; Product Range: MCFY Series; Capacitance: 0.1uF; Capacitance Tolerance: +80%, -20%; Dielectric Characteristic: Y5; Voltage Rating: 50; Capacitor Terminals: Radial Leaded; SVHC: No SVHC (15-Jun-2015); Supplier 1: Mult Comercial; Manufacturer: -; RoHS: YES; Stock 1: 115809; Pricing 1: 1=0.10 (BRL); Packaging: Each; Lead Spacing: 5; Operating Temperature Min: -25; Operating Temperature Max: 85; Capacitance Tolerance ±: +80%, -20%; Operating Temperature Range: -25°C to +85°C<!--FANDB--><div class="features-and-benefits-container"><div class="features-and-benefits-description"><span class="features-benefits-value">The MCFY series from Multicomp are radial leaded ceramic disc capacitors. The capacitance values ranges from 6800pF to 0.22?F.</span></div><div class="features-and-benefits-list"><ul class="features-and-benefits-list-list"><li class="features-and-benefits-list-item">Large capacitance in small size</li><li class="features-and-benefits-list-item">Rated voltage of 50V</li><li class="features-and-benefits-list-item">80%/-20% tolerance</li><li class="features-and-benefits-list-item">Operating temperature range -25°C to +85; ComponentLink1URL: http://loja.multcomercial.com.br/capacitor-ceramico-disco-100kpf-50v-104-100k-100nf-0-1uf-cod-1351.html; ComponentLink1Description: http://loja.multcomercial.com.br/capacitor-ceramico-disco-100kpf-50v-104-100k-100nf-0-1uf-cod-1351.html; Supplier Part Number 1: Capacitor Cerâmico Disco 100Kpf/50V (104/100K/100nF/0.1uF) cód. 1351
C23 C27 = CAP CER 22UF 25V X5R 0805: as C2 on sheet Fujin_Main; Supplier 1: Digi-Key; RoHS: RoHS Compliant; Category: Capacitors; Stock 1: 198871; Pricing 1: 1=0.18, 10=0.124, 25=0.0908, 50=0.0742, 100=0.0627, 250=0.05116, 500=0.0429, 1000=0.03795 (USD); Packaging: Cut Tape (CT); Part Status: Active; Temperature Coefficient: X5R; Mounting Type: Surface Mount, MLCC; Operating Temperature: -55°C ~ 85°C; Applications: General Purpose; Ratings: -; Package / Case: 0805 (2012 Metric); Size / Dimension: 0.079" L x 0.049" W (2.01mm x 1.25mm); Height - Seated (Max): -; Thickness (Max): 0.055" (1.40mm); Lead Spacing: -; Features: -; Lead Style: -; ComponentLink1URL: https://www.lcsc.com/product-detail/Multilayer-Ceramic-Capacitors-MLCC-SMD-SMT_Murata-Electronics-GRM21BR61E226ME44L_C86816.html; ComponentLink1Description: http://datasheets.avx.com/cx5r.pdf; Supplier Part Number 1: 478-5165-1-ND
D10 = PMEG3050EP,115: Schottky Diode; Manufacturer_Name: Nexperia; Datasheet Link: https://assets.nexperia.com/documents/data-sheet/PMEG3050EP.pdf; Height: 1mm; Manufacturer_Part_Number: PMEG3050EP,115; Mouser Part Number: 771-PMEG3050EP115; Mouser Price/Stock: https://www.mouser.co.uk/ProductDetail/Nexperia/PMEG3050EP115?qs=GcY6OjH1zdmnjQ%2FhUT5aOA%3D%3D; Arrow Part Number: PMEG3050EP,115; Arrow Price/Stock: https://www.arrow.com/en/products/pmeg3050ep115/nexperia?region=nac
IC3 IC4 = DRV8874PWPR: Integrated Circuit; Manufacturer_Name: Texas Instruments; Datasheet Link: https://www.ti.com/lit/gpn/DRV8874; Height: 1.2mm; Manufacturer_Part_Number: DRV8874PWPR; Mouser Part Number: 595-DRV8874PWPR; Mouser Price/Stock: https://www.mouser.co.uk/ProductDetail/Texas-Instruments/DRV8874PWPR?qs=mAH9sUMRCtvh%2FSU15ywmDA%3D%3D; Arrow Part Number: DRV8874PWPR; Arrow Price/Stock: https://www.arrow.com/en/products/drv8874pwpr/texas-instruments?region=nac
Q7 = IRLML6344TRPBF: MOSFET (N-Channel); Manufacturer_Name: Infineon; Datasheet Link: https://www.infineon.com/dgdl/irlml6344pbf.pdf?fileId=5546d462533600a4015356689c44262c; Height: 1.12mm; Manufacturer_Part_Number: IRLML6344TRPBF; Mouser Part Number: 942-IRLML6344TRPBF; Mouser Price/Stock: https://www.mouser.co.uk/ProductDetail/Infineon-Technologies/IRLML6344TRPBF?qs=9%252BKlkBgLFf2w4qS48UOXVw%3D%3D; Arrow Part Number: IRLML6344TRPBF; Arrow Price/Stock: https://www.arrow.com/en/products/irlml6344trpbf/infineon-technologies-ag?region=europe
R32 R34 = RES 10K 5%: as R8 on sheet Fujin_Main; RoHS: YES; ComponentLink1URL: http://www.farnell.com/datasheets/1678796.pdf; ComponentLink1Description: http://www.farnell.com/datasheets/1678796.pdf; Category: Resistors; Packaging: Tape & Reel (TR); Resistance (Ohms): 10k; Composition: Thick Film; Features: Automotive AEC-Q200; Operating Temperature: -55°C ~ 155°C; Package / Case: 0603 (1608 Metric); Supplier Device Package: 0603; Size / Dimension: 0.063" L x 0.031" W (1.60mm x 0.80mm); Height: 0.022" (0.55mm); Number of Terminations: 2; ComponentLink2URL: http://industrial.panasonic.com/www-cgi/jvcr13pz.cgi?E+PZ+3+AOA0001+ERJ3GEYJ103V+7+WW; ComponentLink2Description: http://industrial.panasonic.com/www-cgi/jvcr13pz.cgi?E+PZ+3+AOA0001+ERJ3GEYJ103V+7+WW
R33 R35 = RES 2K 1%_1: Resistor 2K 1% tolerance; Manufacturer: Ty-Ohm; Manufacturer Part Number: CR25; Tolerance: ±5%; Power (Watts): 0.25W, 1/4W; Temperature Coefficient: 0/ -500ppm/°C; Supplier 1: Mult Comercial; RoHS: RoHS Compliant; Category: Resistors; Stock 1: 617543; Pricing 1: 1=0.20 (BRL); Packaging: Cut Tape (CT); Composition: Carbon Film; Features: Flame Retardant Coating, Safety; Operating Temperature: -55°C ~ 155°C; Package / Case: Axial; Supplier Device Package: Axial; Size / Dimension: 0.091" Dia x 0.256" L (2.30mm x 6.50mm); Height: -; Number of Terminations: 2; ComponentLink1URL: http://loja.multcomercial.com.br/resistor-de-1-4-de-watt-cr25-5-de-tolerancia.html; ComponentLink1Description: http://loja.multcomercial.com.br/resistor-de-1-4-de-watt-cr25-5-de-tolerancia.html; Supplier Part Number 1: Resistor de Filme de Carbono 1/4 de Watt CR25 5% de tolerância - 0.22R Ω à 10M Ω; Resistance (Ohms): ?
R36 = RES 47R 5%: as R13 on sheet Fujin_Peripherals; Supplier 1: Mult Comercial; RoHS: RoHS Compliant; Category: Resistors; Stock 1: 617543; Pricing 1: 1=0.20 (BRL); Packaging: Cut Tape (CT); Composition: Carbon Film; Features: Flame Retardant Coating, Safety; Operating Temperature: -55°C ~ 155°C; Package / Case: Axial; Supplier Device Package: Axial; Size / Dimension: 0.091" Dia x 0.256" L (2.30mm x 6.50mm); Height: -; Number of Terminations: 2; ComponentLink1URL: http://loja.multcomercial.com.br/resistor-de-1-4-de-watt-cr25-5-de-tolerancia.html; ComponentLink1Description: http://loja.multcomercial.com.br/resistor-de-1-4-de-watt-cr25-5-de-tolerancia.html; Supplier Part Number 1: Resistor de Filme de Carbono 1/4 de Watt CR25 5% de tolerância - 0.22R Ω à 10M Ω
R37 = RES 47K 5%: as R21 on sheet Fujin_Peripherals; Supplier 1: Mult Comercial; RoHS: RoHS Compliant; Category: Resistors; Stock 1: 617543; Pricing 1: 1=0.20 (BRL); Packaging: Cut Tape (CT); Composition: Carbon Film; Features: Flame Retardant Coating, Safety; Operating Temperature: -55°C ~ 155°C; Package / Case: Axial; Supplier Device Package: Axial; Size / Dimension: 0.091" Dia x 0.256" L (2.30mm x 6.50mm); Height: -; Number of Terminations: 2; ComponentLink1URL: http://loja.multcomercial.com.br/resistor-de-1-4-de-watt-cr25-5-de-tolerancia.html; ComponentLink1Description: http://loja.multcomercial.com.br/resistor-de-1-4-de-watt-cr25-5-de-tolerancia.html; Supplier Part Number 1: Resistor de Filme de Carbono 1/4 de Watt CR25 5% de tolerância - 0.22R Ω à 10M Ω

## Sheet Fujin_Connectors.SchDoc
size A4; SheetNumber: 4; SheetTotal: 4
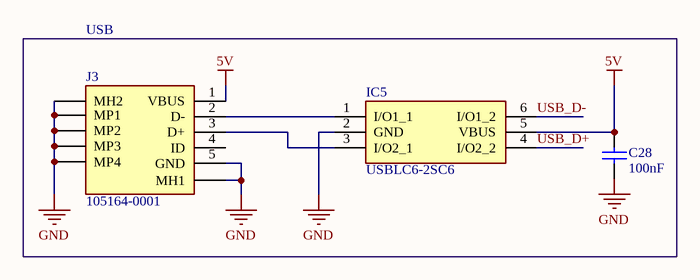
[diagram p3: Fujin_Connectors.SchDoc]

### Parts
C28  100nF  [CAP 0402]
IC5  USBLC6-2SC6  [SOT95P280X145-6N]
J3  105164-0001  [1051640001]

### Blocks framed on the sheet
USB: C28 IC5 J3

### Nets
5V: C28.2 IC5.5(VBUS) J3.1(VBUS)
GND: C28.1 IC5.2(GND) J3.5(GND) J3.MH1 J3.MH2 J3.MP1 J3.MP2 J3.MP3 J3.MP4
USB_D+: IC5.4(I/O2_2)
USB_D-: IC5.6(I/O1_2)
NetIC5_1: IC5.1(I/O1_1) J3.2(D-)
NetIC5_3: IC5.3(I/O2_1) J3.3(D+)

Not connected (* = marked no-connect by the designer): J3 4(ID)

### Library data of the parts
C28 = CAP 100NF 50V 0402: as C7 on sheet Fujin_Main; Supplier 1: Mult Comercial; Manufacturer: -; RoHS: YES; Stock 1: 115809; Pricing 1: 1=0.10 (BRL); Packaging: Each; Lead Spacing: 5; Operating Temperature Min: -25; Operating Temperature Max: 85; Capacitance Tolerance ±: +80%, -20%; Operating Temperature Range: -25°C to +85°C<!--FANDB--><div class="features-and-benefits-container"><div class="features-and-benefits-description"><span class="features-benefits-value">The MCFY series from Multicomp are radial leaded ceramic disc capacitors. The capacitance values ranges from 6800pF to 0.22?F.</span></div><div class="features-and-benefits-list"><ul class="features-and-benefits-list-list"><li class="features-and-benefits-list-item">Large capacitance in small size</li><li class="features-and-benefits-list-item">Rated voltage of 50V</li><li class="features-and-benefits-list-item">80%/-20% tolerance</li><li class="features-and-benefits-list-item">Operating temperature range -25°C to +85; ComponentLink1URL: http://loja.multcomercial.com.br/capacitor-ceramico-disco-100kpf-50v-104-100k-100nf-0-1uf-cod-1351.html; ComponentLink1Description: http://loja.multcomercial.com.br/capacitor-ceramico-disco-100kpf-50v-104-100k-100nf-0-1uf-cod-1351.html; Supplier Part Number 1: Capacitor Cerâmico Disco 100Kpf/50V (104/100K/100nF/0.1uF) cód. 1351
IC5 = USBLC6-2SC6: Integrated Circuit; Manufacturer_Name: STMicroelectronics; Datasheet Link: http://www.st.com/st-web-ui/static/active/en/resource/technical/document/datasheet/CD00050750.pdf; Height: 1.45mm; Manufacturer_Part_Number: USBLC6-2SC6; Mouser Part Number: 511-USBLC6-2SC6; Mouser Price/Stock: https://www.mouser.co.uk/ProductDetail/STMicroelectronics/USBLC6-2SC6?qs=po45yt2pPpu%2FhNIlwQdTlg%3D%3D; Arrow Part Number: USBLC6-2SC6; Arrow Price/Stock: https://www.arrow.com/en/products/usblc6-2sc6/stmicroelectronics?region=nac
J3 = 105164-0001: Connector; Manufacturer_Name: Molex; Datasheet Link: https://www.molex.com/pdm_docs/sd/1051640001_sd.pdf; Height: 2.7mm; Manufacturer_Part_Number: 105164-0001; Mouser Part Number: 538-105164-0001; Mouser Price/Stock: https://www.mouser.co.uk/ProductDetail/Molex/105164-0001?qs=JAwGc6FMfvtRY4SkW%2FoGcQ%3D%3D

## Nets that join several sheets
3V3: Fujin_Main (21 pins), Fujin_Peripherals (20 pins), Fujin_Motors (8 pins)
5V: Fujin_Main (5 pins), Fujin_Peripherals (D7.1 D8.1), Fujin_Connectors (C28.2 IC5.5 J3.1)
GND: Fujin_Main (37 pins), Fujin_Peripherals (30 pins), Fujin_Motors (20 pins), Fujin_Connectors (9 pins)
VCC: Fujin_Main (5 pins), Fujin_Motors (10 pins)
BLE_RX: Fujin_Main (IC1.22), Fujin_Peripherals (U7.14)
BLE_TX: Fujin_Main (IC1.23), Fujin_Peripherals (U7.15)
BUZZER: Fujin_Main (IC1.38), Fujin_Peripherals (R25.1)
EEPROM_SCL: Fujin_Main (IC1.40), Fujin_Peripherals (IC2.6 R30.1)
EEPROM_SDA: Fujin_Main (IC1.41), Fujin_Peripherals (IC2.5 R31.1)
ENC_1_A: Fujin_Main (IC1.14), Fujin_Motors (J1.7)
ENC_1_B: Fujin_Main (IC1.17), Fujin_Motors (J1.8)
ENC_2_A: Fujin_Main (IC1.39), Fujin_Motors (J2.7)
ENC_2_B: Fujin_Main (IC1.37), Fujin_Motors (J2.8)
I2C2_SCL: Fujin_Main (IC1.43), Fujin_Peripherals (B1.13 R28.1)
I2C2_SDA: Fujin_Main (IC1.42), Fujin_Peripherals (B1.14 R27.1)
LED_L_F: Fujin_Main (IC1.57), Fujin_Peripherals (R13.2)
LED_L_S: Fujin_Main (IC1.56), Fujin_Peripherals (R14.2)
LED_R_F: Fujin_Main (IC1.54), Fujin_Peripherals (R15.2)
LED_R_S: Fujin_Main (IC1.55), Fujin_Peripherals (R16.2)
MOT1_ADC: Fujin_Main (IC1.18), Fujin_Motors (IC3.6 R33.2)
MOT1_DIR: Fujin_Main (IC1.10), Fujin_Motors (IC3.2)
MOT1_PWM: Fujin_Main (IC1.11), Fujin_Motors (IC3.1)
MOT2_ADC: Fujin_Main (IC1.26), Fujin_Motors (IC4.6 R35.2)
MOT2_DIR: Fujin_Main (IC1.8), Fujin_Motors (IC4.2)
MOT2_PWM: Fujin_Main (IC1.9), Fujin_Motors (IC4.1)
MOT_FAN: Fujin_Main (IC1.58), Fujin_Motors (R36.1)
SEN_L_F: Fujin_Main (IC1.13), Fujin_Peripherals (R17.2 U3.1)
SEN_L_S: Fujin_Main (IC1.12), Fujin_Peripherals (R18.2 U4.1)
SEN_R_F: Fujin_Main (IC1.33), Fujin_Peripherals (R19.2 U5.1)
SEN_R_S: Fujin_Main (IC1.34), Fujin_Peripherals (R20.2 U6.1)
SPI_CLK: Fujin_Main (IC1.19), Fujin_Motors (J1.2 J2.2)
SPI_CS_1: Fujin_Main (IC1.25), Fujin_Motors (J1.1)
SPI_CS_2: Fujin_Main (IC1.30), Fujin_Motors (J2.1)
SPI_MISO: Fujin_Main (IC1.20), Fujin_Motors (J1.3 J2.3)
SPI_MOSI: Fujin_Main (IC1.21), Fujin_Motors (J1.4 J2.4)
USB_D+: Fujin_Main (IC1.46), Fujin_Connectors (IC5.4)
USB_D-: Fujin_Main (IC1.45), Fujin_Connectors (IC5.6)
WS2812_IN1: Fujin_Main (IC1.51), Fujin_Peripherals (D8.4)